# EAGLE schematic field_recorder (EAGLE 5.10)
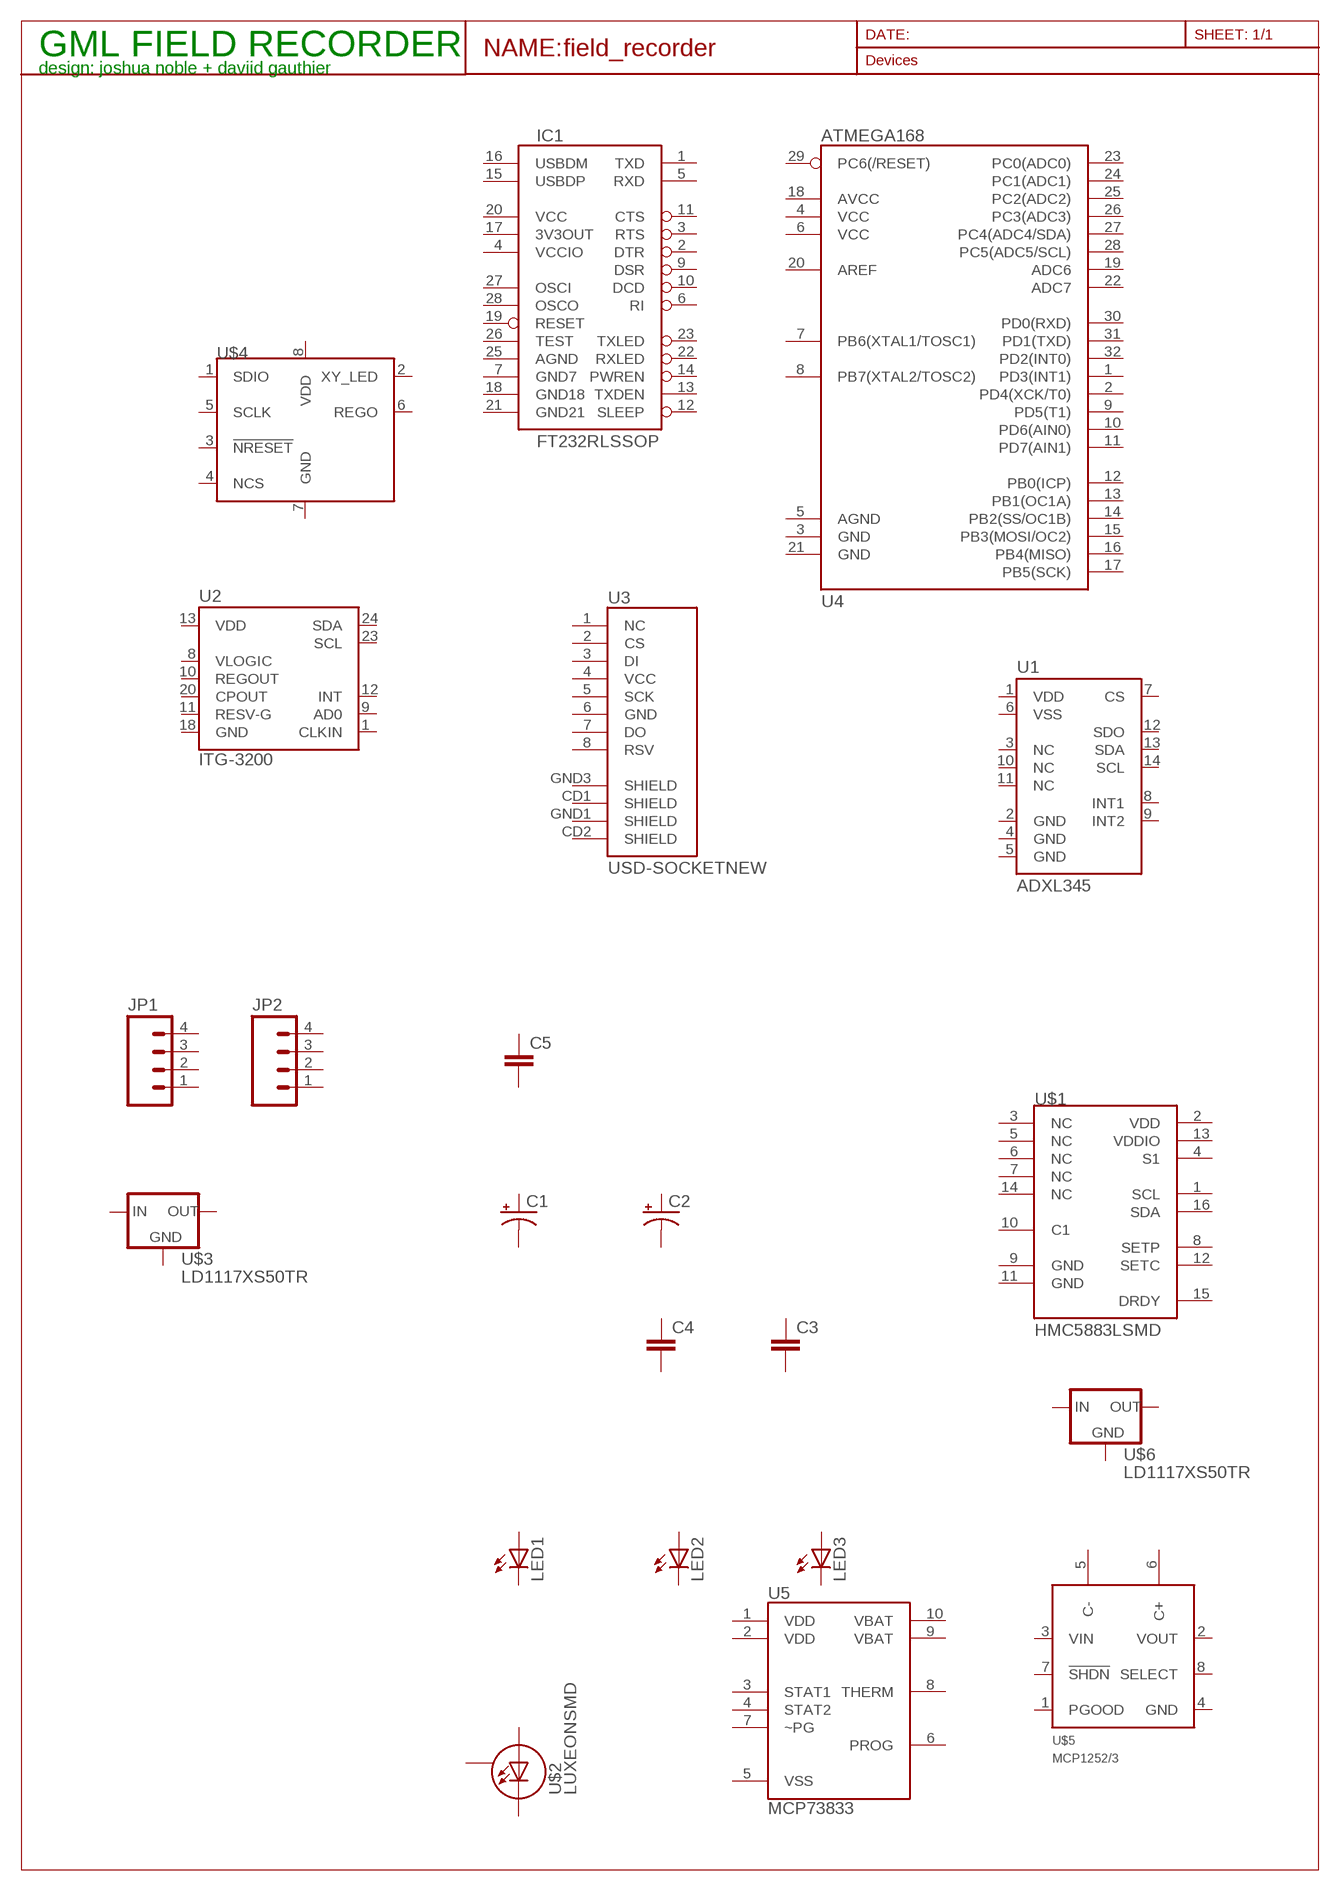
[diagram p0: schematic, sheet 1]

## Parts
C1  CAP_POL1206  [EIA3216]
C2  CAP_POL1206  [EIA3216]
C3  CAP0402-CAP  [0402-CAP]
C4  CAP0402-CAP  [0402-CAP]
C5  CAPPTH  [CAP-PTH-SMALL]
IC1  FT232RLSSOP  [SSOP28DB]
JP1  M04PTH  [1X04]
JP2  M04PTH  [1X04]
LED1  LED5MM  [LED5MM]
LED2  LED5MM  [LED5MM]
LED3  LED5MM  [LED5MM]
U1  ADXL345  [LGA14]
U2  ITG-3200  [QFN-24]
U3  USD-SOCKETNEW  [MICRO-SD-SOCKET-PP]
U4  ATMEGA168  [TQFP32-08]
U5  MCP73833  [MSOP-10]
U$1  HMC5883LSMD  [16LPCC]
U$2  LUXEONSMD  [LUXEON]
U$3  LD1117XS50TR  [SOT223]
U$4  ADNS-5050  [DIP8-1MMSHIFT]
U$5  MCP1252/3  [MSOP8]
U$6  LD1117XS50TR  [SOT223]
Unconnected: C1.A(+) C1.C(-) C2.A(+) C2.C(-) C3.1 C3.2 C4.1 C4.2 C5.1 C5.2 IC1.1(TXD) IC1.2(DTR) IC1.3(RTS) IC1.5(RXD) IC1.6(RI) IC1.9(DSR) IC1.10(DCD) IC1.11(CTS) IC1.12(SLEEP) IC1.13(TXDEN) IC1.14(PWREN) IC1.15(USBDP) IC1.16(USBDM) IC1.17(3V3OUT) IC1.19(RESET) IC1.22(RXLED) IC1.23(TXLED) IC1.26(TEST) IC1.27(OSCI) IC1.28(OSCO) JP1.1 JP1.2 JP1.3 JP1.4 JP2.1 JP2.2 JP2.3 JP2.4 LED1.A LED1.K(C) LED2.A LED2.K(C) LED3.A LED3.K(C) U1.1(VDD) U1.2(GND) U1.3(NC) U1.4(GND) U1.5(GND) U1.6(VSS) U1.7(CS) U1.8(INT1) U1.9(INT2) U1.10(NC) U1.11(NC) U1.12(SDO) U1.13(SDA) U1.14(SCL) U2.1(CLKIN) U2.8(VLOGIC) U2.9(AD0) U2.10(REGOUT) U2.11(RESV-G) U2.12(INT) U2.13(VDD) U2.18(GND) U2.20(CPOUT) U2.23(SCL) U2.24(SDA) U3.1(NC) U3.2(CS) U3.3(DI) U3.4(VCC) U3.5(SCK) U3.6(GND) U3.7(DO) U3.8(RSV) U3.CD1(SHIELD) U3.CD2(SHIELD) U3.GND1(SHIELD) U3.GND3(SHIELD) U4.1(PD3(INT1)) U4.2(PD4(XCK/T0)) U4.3(GND) U4.4(VCC) U4.5(AGND) U4.6(VCC) U4.7(PB6(XTAL1/TOSC1)) U4.8(PB7(XTAL2/TOSC2)) U4.9(PD5(T1)) U4.10(PD6(AIN0)) U4.11(PD7(AIN1)) U4.12(PB0(ICP)) U4.13(PB1(OC1A)) U4.14(PB2(SS/OC1B)) U4.15(PB3(MOSI/OC2)) U4.16(PB4(MISO)) U4.17(PB5(SCK)) U4.18(AVCC) U4.19(ADC6) U4.20(AREF) U4.21(GND) U4.22(ADC7) U4.23(PC0(ADC0)) U4.24(PC1(ADC1)) U4.25(PC2(ADC2)) U4.26(PC3(ADC3)) U4.27(PC4(ADC4/SDA)) U4.28(PC5(ADC5/SCL)) U4.29(PC6(/RESET)) U4.30(PD0(RXD)) U4.31(PD1(TXD)) U4.32(PD2(INT0)) U5.1(VDD) U5.2(VDD) U5.3(STAT1) U5.4(STAT2) U5.5(VSS) U5.6(PROG) U5.7(~PG) U5.8(THERM) U5.9(VBAT) U5.10(VBAT) U$1.1(SCL) U$1.2(VDD) U$1.3(NC) U$1.4(S1) U$1.5(NC) U$1.6(NC) U$1.7(NC) U$1.8(SETP) U$1.9(GND) U$1.10(C1) U$1.11(GND) U$1.12(SETC) U$1.13(VDDIO) U$1.14(NC) U$1.15(DRDY) U$1.16(SDA) U$2.A U$2.C U$2.S U$3.1(GND) U$3.2(OUT) U$3.3(IN) U$3.4(GND) U$4.1(SDIO) U$4.2(XY_LED) U$4.3(!NRESET) U$4.4(NCS) U$4.5(SCLK) U$4.6(REGO) U$5.1(PGOOD) U$5.7(!SHDN) U$5.8(SELECT) U$6.1(GND) U$6.2(OUT) U$6.3(IN) U$6.4(GND)

## Notes on the sheet
- GML FIELD RECORDER
- design: joshua noble + daviid gauthier

## Power pins joined to a net without a drawn wire
AGND: IC1.25(AGND)
C+: U$5.6(C+)
C-: U$5.5(C-)
GND: U$4.7(GND) U$5.4(GND)
GND7: IC1.7(GND7)
GND18: IC1.18(GND18)
GND21: IC1.21(GND21)
VCC: IC1.20(VCC)
VCCIO: IC1.4(VCCIO)
VDD: U$4.8(VDD)
VIN: U$5.3(VIN)
VOUT: U$5.2(VOUT)

## Library data of the parts
C1 C2 = SparkFun:CAP_POL: Capacitor Polarized These are standard SMD and PTH capacitors. Normally 10uF, 47uF, and 100uF in electrolytic and tantalum varieties. Always verify the external diameter of the through hole cap, it varies with capacity, voltage, and manufacturer. The EIA devices should be standard.
C3-C5 = SparkFun:CAP: Capacitor Standard 0603 ceramic capacitor, and 0.1" leaded capacitor.
IC1 = fieldrec:FT232RL: USB UART FT232RL 4th Generation USB UART (USB <-> Serial) Controller. Spark Fun Electronics SKU : COM-00650
JP1 JP2 = SparkFun:M04: Header 4 Standard 4-pin 0.1" header. Use with straight break away headers (SKU : PRT-00116), right angle break away headers (PRT-00553), swiss pins (PRT-00743), machine pins (PRT-00117), and female headers (PRT-00115). Molex polarized connector foot print use with SKU : PRT-08231 with associated crimp pins and housings. 1MM SMD Version SKU: PRT-10208
LED1-LED3 = SparkFun:LED: LEDs Standard schematic elements and footprints for 5mm, 3mm, 1206, and 0603 sized LEDs. 5mm - Spark Fun Electronics SKU : COM-00529 (and others)
U1 = fieldrec:ADXL345
U2 = fieldrec:ITG-3200: ITG-3200 3-axis gyro, digital output, qfn24 package
U3 = fieldrec:USD-SOCKET: microSD Socket Push-push type uSD socket. Schematic element and footprint production proven. Spark Fun Electronics SKU : PRT-00127. tDoc lines correctly indicate media card edge positions when inserting (unlocked, locked, depressed).
U4 = fieldrec:ATMEGA168
U5 = fieldrec:MCP73833: Microchip MCP73833 Stand-alone Linear Li-ion/Li-polymer Charge Management Controller Packages: DFN-10, MSOP-10 Last modified: 8/17/10 Unproven!
U$1 = fieldrec:HMC5883L: 3 Axis Digital Compass IC
U$2 = SparkFun:LUXEON: Luxeon LED This footprint works with the current 1 Watt, 3 Watt, and 5 Watt LEDs. These blindingly bright LEDs generate a lot of heat so the footprint has a large pad under the LED for thermal transfer. Schematic and footprint are proven. Spark Fun Electronics SKU : COM-00603
U$3 U$6 = fieldrec:LD1117X: Adjustable and fixed low drop positive voltage regulator
U$4 = fieldrec:ADNS-5050: The ADNS-5050 is a mainstream, small form factor optical mouse sensor.
U$5 = fieldrec:MCP1252/3: The MCP1252/3 are inductorless, positive-regulated charge pump DC/DC converters. The devices generate a regulated fixed (3.3V or 5.0V) or adjustable output voltage.